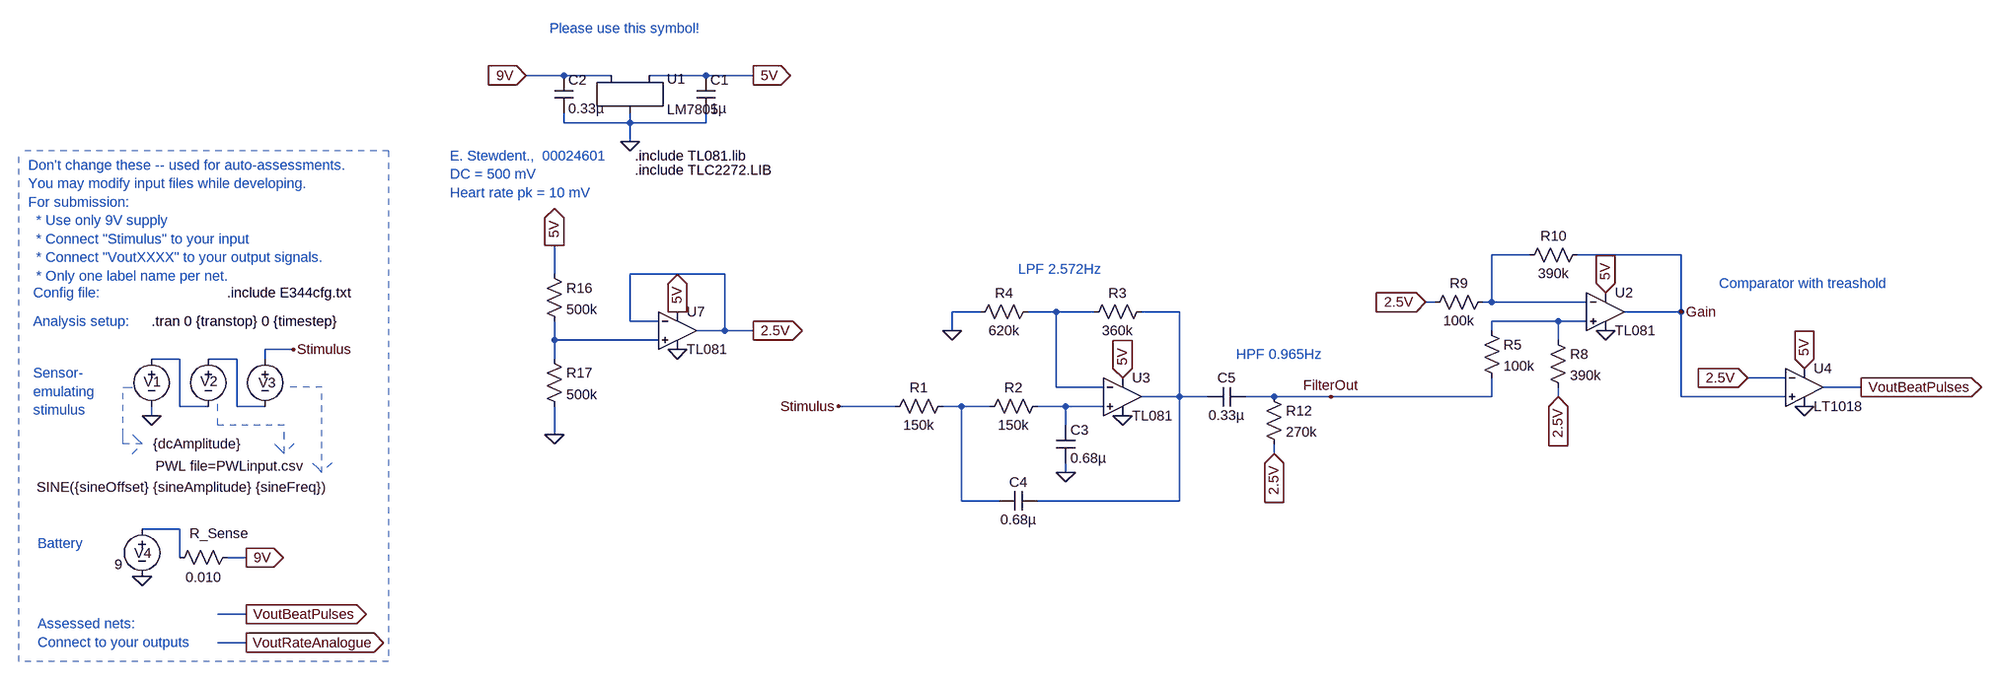
[diagram p0: schematic Bannister_20889356_A2.asc]
Bannister_20889356_A2.asc, the LTspice schematic file:
Version 4
SHEET 1 5012 1600
WIRE -1360 -1536 -1424 -1536
WIRE -1280 -1536 -1360 -1536
WIRE -1120 -1536 -1216 -1536
WIRE -1040 -1536 -1120 -1536
WIRE -1360 -1456 -1360 -1472
WIRE -1248 -1456 -1248 -1472
WIRE -1248 -1456 -1360 -1456
WIRE -1120 -1456 -1120 -1472
WIRE -1120 -1456 -1248 -1456
WIRE -1248 -1424 -1248 -1456
WIRE 272 -1232 208 -1232
WIRE 528 -1232 352 -1232
WIRE -1376 -1200 -1376 -1248
WIRE -1088 -1200 -1248 -1200
WIRE 112 -1152 96 -1152
WIRE 208 -1152 208 -1232
WIRE 208 -1152 192 -1152
WIRE 368 -1152 208 -1152
WIRE -656 -1136 -704 -1136
WIRE -528 -1136 -576 -1136
WIRE -464 -1136 -528 -1136
WIRE -320 -1136 -384 -1136
WIRE 528 -1136 528 -1232
WIRE 528 -1136 432 -1136
WIRE -1248 -1120 -1248 -1200
WIRE -1200 -1120 -1248 -1120
WIRE 320 -1120 208 -1120
WIRE 368 -1120 320 -1120
WIRE -1088 -1104 -1088 -1200
WIRE -1088 -1104 -1136 -1104
WIRE -1040 -1104 -1088 -1104
WIRE -704 -1104 -704 -1136
WIRE 208 -1104 208 -1120
WIRE -1376 -1088 -1376 -1120
WIRE -1200 -1088 -1376 -1088
WIRE 320 -1088 320 -1120
WIRE -1840 -1072 -1888 -1072
WIRE -2032 -1056 -2080 -1056
WIRE -1936 -1056 -1984 -1056
WIRE -1888 -1056 -1888 -1072
WIRE -1376 -1056 -1376 -1088
WIRE 704 -1024 640 -1024
WIRE -528 -1008 -528 -1136
WIRE -448 -1008 -528 -1008
WIRE 832 -1008 768 -1008
WIRE -320 -992 -320 -1136
WIRE -320 -992 -384 -992
WIRE -272 -992 -320 -992
WIRE -160 -992 -208 -992
WIRE -64 -992 -160 -992
WIRE 208 -992 208 -1024
WIRE 208 -992 -64 -992
WIRE 320 -992 320 -1008
WIRE 528 -992 528 -1136
WIRE 704 -992 528 -992
WIRE -2032 -976 -2032 -1056
WIRE -1984 -976 -2032 -976
WIRE -1936 -976 -1936 -1056
WIRE -1888 -976 -1936 -976
WIRE -800 -976 -896 -976
WIRE -688 -976 -720 -976
WIRE -640 -976 -688 -976
WIRE -512 -976 -560 -976
WIRE -448 -976 -512 -976
WIRE -2080 -960 -2080 -976
WIRE -512 -944 -512 -976
WIRE -1376 -928 -1376 -976
WIRE -160 -896 -160 -912
WIRE -512 -864 -512 -880
WIRE -688 -816 -688 -976
WIRE -624 -816 -688 -816
WIRE -320 -816 -320 -992
WIRE -320 -816 -560 -816
WIRE -2032 -768 -2096 -768
WIRE -2032 -720 -2032 -768
WIRE -1920 -720 -1952 -720
WIRE -1920 -624 -1968 -624
WIRE -1920 -576 -1968 -576
FLAG -2080 -960 0
FLAG -1840 -1072 Stimulus
FLAG -1920 -720 9V
IOPIN -1920 -720 Out
FLAG -2096 -688 0
FLAG -1920 -624 VoutBeatPulses
IOPIN -1920 -624 Out
FLAG -1920 -576 VoutRateAnalogue
IOPIN -1920 -576 Out
FLAG 832 -1008 VoutBeatPulses
IOPIN 832 -1008 Out
FLAG -1248 -1424 0
FLAG -896 -976 Stimulus
FLAG -1424 -1536 9V
IOPIN -1424 -1536 In
FLAG -1040 -1536 5V
IOPIN -1040 -1536 Out
FLAG -512 -864 0
FLAG -416 -960 0
FLAG -704 -1104 0
FLAG -416 -1024 5V
IOPIN -416 -1024 In
FLAG 736 -976 0
FLAG 736 -1040 5V
IOPIN 736 -1040 In
FLAG -64 -992 FilterOut
FLAG 400 -1168 5V
IOPIN 400 -1168 In
FLAG 400 -1104 0
FLAG 528 -1136 Gain
FLAG -1376 -928 0
FLAG -1376 -1248 5V
IOPIN -1376 -1248 Out
FLAG -1168 -1136 5V
IOPIN -1168 -1136 Out
FLAG -1168 -1072 0
FLAG -1040 -1104 2.5V
IOPIN -1040 -1104 Out
FLAG 320 -992 2.5V
IOPIN 320 -992 In
FLAG 96 -1152 2.5V
IOPIN 96 -1152 In
FLAG 640 -1024 2.5V
IOPIN 640 -1024 In
FLAG -160 -896 2.5V
IOPIN -160 -896 In
SYMBOL voltage -1984 -1072 R0
WINDOW 123 0 0 Left 0
WINDOW 39 0 0 Left 0
WINDOW 3 -89 197 Left 2
WINDOW 0 -13 54 Left 2
SYMATTR Value PWL file=PWLinput.csv
SYMATTR InstName V2
SYMBOL voltage -1888 -1072 R0
WINDOW 123 24 44 Left 2
WINDOW 39 0 0 Left 0
WINDOW 3 -386 233 Left 2
WINDOW 0 -11 56 Left 2
SYMATTR Value SINE({sineOffset} {sineAmplitude} {sineFreq})
SYMATTR InstName V3
SYMBOL voltage -2080 -1072 R0
WINDOW 123 0 0 Left 0
WINDOW 39 0 0 Left 0
WINDOW 3 3 160 Left 2
WINDOW 0 -13 55 Left 2
SYMATTR Value {dcAmplitude}
SYMATTR InstName V1
SYMBOL voltage -2096 -784 R0
WINDOW 123 24 44 Left 2
WINDOW 39 0 0 Left 0
WINDOW 3 -46 76 Left 2
WINDOW 0 -13 57 Left 2
SYMATTR Value 9
SYMATTR InstName V4
SYMBOL res -1936 -736 R90
WINDOW 0 -9 30 VBottom 2
WINDOW 3 34 56 VTop 2
SYMATTR InstName R_Sense
SYMATTR Value 0.010
SYMBOL LM7805 -1248 -1520 R0
SYMATTR InstName U1
SYMBOL cap -1136 -1536 R0
SYMATTR InstName C1
SYMATTR Value 1µ
SYMBOL cap -1376 -1536 R0
SYMATTR InstName C2
SYMATTR Value 0.33µ
SYMBOL res -704 -992 R90
WINDOW 0 0 56 VBottom 2
WINDOW 3 32 56 VTop 2
SYMATTR InstName R1
SYMATTR Value 150k
SYMBOL res -544 -992 R90
WINDOW 0 0 56 VBottom 2
WINDOW 3 32 56 VTop 2
SYMATTR InstName R2
SYMATTR Value 150k
SYMBOL res -368 -1152 R90
WINDOW 0 0 56 VBottom 2
WINDOW 3 32 56 VTop 2
SYMATTR InstName R3
SYMATTR Value 360k
SYMBOL res -560 -1152 R90
WINDOW 0 0 56 VBottom 2
WINDOW 3 32 56 VTop 2
SYMATTR InstName R4
SYMATTR Value 620k
SYMBOL cap -528 -944 R0
SYMATTR InstName C3
SYMATTR Value 0.68µ
SYMBOL cap -560 -832 R90
WINDOW 0 0 32 VBottom 2
WINDOW 3 32 32 VTop 2
SYMATTR InstName C4
SYMATTR Value 0.68µ
SYMBOL Opamps\\opamp2 -416 -1056 R0
SYMATTR InstName U3
SYMATTR Value TL081
SYMBOL Comparators\\LT1018 736 -1008 R0
SYMATTR InstName U4
SYMBOL res 208 -1168 R90
WINDOW 0 0 56 VBottom 2
WINDOW 3 32 56 VTop 2
SYMATTR InstName R9
SYMATTR Value 100k
SYMBOL res 368 -1248 R90
WINDOW 0 0 56 VBottom 2
WINDOW 3 32 56 VTop 2
SYMATTR InstName R10
SYMATTR Value 390k
SYMBOL Opamps\\opamp2 400 -1200 R0
SYMATTR InstName U2
SYMATTR Value TL081
SYMBOL res -176 -1008 R0
SYMATTR InstName R12
SYMATTR Value 270k
SYMBOL Opamps\\opamp2 -1168 -1168 R0
SYMATTR InstName U7
SYMATTR Value TL081
SYMBOL res -1392 -1216 R0
SYMATTR InstName R16
SYMATTR Value 500k
SYMBOL res -1392 -1072 R0
SYMATTR InstName R17
SYMATTR Value 500k
SYMBOL res 192 -1120 R0
SYMATTR InstName R5
SYMATTR Value 100k
SYMBOL res 304 -1104 R0
SYMATTR InstName R8
SYMATTR Value 390k
SYMBOL cap -208 -1008 R90
WINDOW 0 0 32 VBottom 2
WINDOW 3 32 32 VTop 2
SYMATTR InstName C5
SYMATTR Value 0.33µ
TEXT -2080 -1120 Left 2 !.tran 0 {transtop} 0 {timestep}
TEXT -1952 -1168 Left 2 !.include E344cfg.txt
TEXT -2288 -1384 Left 2 ;Don't change these -- used for auto-assessments.\nYou may modify input files while developing.\nFor submission: \n  * Use only 9V supply \n  * Connect "Stimulus" to your input\n  * Connect "VoutXXXX" to your output signals.\n  * Only one label name per net.
TEXT -2280 -1168 Left 2 ;Config file:
TEXT -2280 -1120 Left 2 ;Analysis setup:
TEXT -2272 -744 Left 2 ;Battery
TEXT -2280 -1032 Left 2 ;Sensor-\nemulating \nstimulus
TEXT -2272 -608 Left 2 ;Assessed nets:\nConnect to your outputs
TEXT -1552 -1400 Left 2 ;E. Stewdent.,  00024601\nDC = 500 mV\nHeart rate pk = 10 mV
TEXT -1384 -1616 Left 2 ;Please use this symbol!
TEXT -1240 -1400 Left 2 !.include TL081.lib
TEXT -592 -1208 Left 2 ;LPF 2.572Hz
TEXT 592 -1184 Left 2 ;Comparator with treashold
TEXT -1240 -1376 Left 2 !.include TLC2272.LIB
TEXT -224 -1064 Left 2 ;HPF 0.965Hz
LINE Normal -1792 -1008 -1856 -1008 2
LINE Normal -1792 -864 -1792 -1008 2
LINE Normal -1808 -880 -1792 -864 2
LINE Normal -1792 -864 -1808 -880 2
LINE Normal -1776 -880 -1792 -864 2
LINE Normal -2128 -1008 -2112 -1008 2
LINE Normal -2128 -928 -2128 -1008 2
LINE Normal -2128 -912 -2128 -928 2
LINE Normal -2096 -912 -2128 -912 2
LINE Normal -2112 -928 -2096 -912 2
LINE Normal -2096 -912 -2112 -928 2
LINE Normal -2112 -896 -2096 -912 2
LINE Normal -1968 -944 -1968 -992 2
LINE Normal -1856 -944 -1968 -944 2
LINE Normal -1856 -896 -1856 -944 2
LINE Normal -1872 -912 -1856 -896 2
LINE Normal -1856 -896 -1872 -912 2
LINE Normal -1840 -912 -1856 -896 2
LINE Normal -2304 -544 -2304 -1408 1
LINE Normal -1680 -1408 -1680 -544 1
LINE Normal -1680 -544 -2304 -544 1
LINE Normal -1680 -1408 -2304 -1408 1

The netlist it stands for:
* Bannister_20889356_A2.asc
V2 N007 N006 PWL file=PWLinput.csv
V3 Stimulus N007 SINE({sineOffset} {sineAmplitude} {sineFreq})
V1 N006 0 {dcAmplitude}
V4 N010 0 9
R_Sense 9V N010 0.010
XU1 9V 0 5V LM7805
C1 5V 0 1µ
C2 9V 0 0.33µ
R1 N008 Stimulus 150k
R2 N009 N008 150k
R3 N003 N002 360k
R4 N002 0 620k
C3 N009 0 0.68µ
C4 N003 N008 0.68µ
XU3 N009 N002 5V 0 N003 TL081  ; pins In+ In- V+ V- OUT
XU4 Gain 2.5V 5V 0 VoutBeatPulses LT1018  ; pins In+ In- V+ V- OUT
R9 N001 2.5V 100k
R10 Gain N001 390k
XU2 N004 N001 5V 0 Gain TL081  ; pins In+ In- V+ V- OUT
R12 FilterOut 2.5V 270k
XU7 N005 2.5V 5V 0 2.5V TL081  ; pins In+ In- V+ V- OUT
R16 5V N005 500k
R17 N005 0 500k
R5 N004 FilterOut 100k
R8 N004 2.5V 390k
C5 FilterOut N003 0.33µ
.tran 0 {transtop} 0 {timestep}
.include E344cfg.txt
* Don't change these -- used for auto-assessments.
* You may modify input files while developing.
* For submission:
*   * Use only 9V supply
*   * Connect "Stimulus" to your input
*   * Connect "VoutXXXX" to your output signals.
*   * Only one label name per net.
* Config file:
* Analysis setup:
* Battery
* Sensor-
* emulating
* stimulus
* Assessed nets:
* Connect to your outputs
* E. Stewdent.,  00024601
* DC = 500 mV
* Heart rate pk = 10 mV
* Please use this symbol!
.include TL081.lib
* LPF 2.572Hz
* Comparator with treashold
.include TLC2272.LIB
* HPF 0.965Hz
.lib LTC1.lib
.backanno
.end